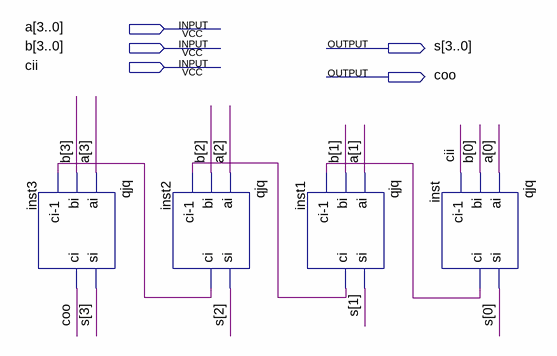
[diagram p0: schematic sheet]
// Quartus schematic add4.bdf as structural Verilog: 4 symbols, 5 pins
module add4 (
  input  [3:0] a,
  input  [3:0] b,
  input  cii,
  output [3:0] s,
  output coo
);

  wire inst1_ci, inst2_ci, inst_ci;

  qjq inst3 (.ai(a[3]), .bi(b[3]), .\ci-1 (inst2_ci), .si(s[3]), .ci(coo));
  qjq inst2 (.ai(a[2]), .bi(b[2]), .\ci-1 (inst1_ci), .si(s[2]), .ci(inst2_ci));
  qjq inst1 (.ai(a[1]), .bi(b[1]), .\ci-1 (inst_ci), .si(s[1]), .ci(inst1_ci));
  qjq inst (.ai(a[0]), .bi(b[0]), .\ci-1 (cii), .si(s[0]), .ci(inst_ci));
endmodule
